# Altium schematic sheet 14_HD4_PUMP.SchDoc
size 420 x 297 mm; SheetNumber: 22; SheetTotal: 24
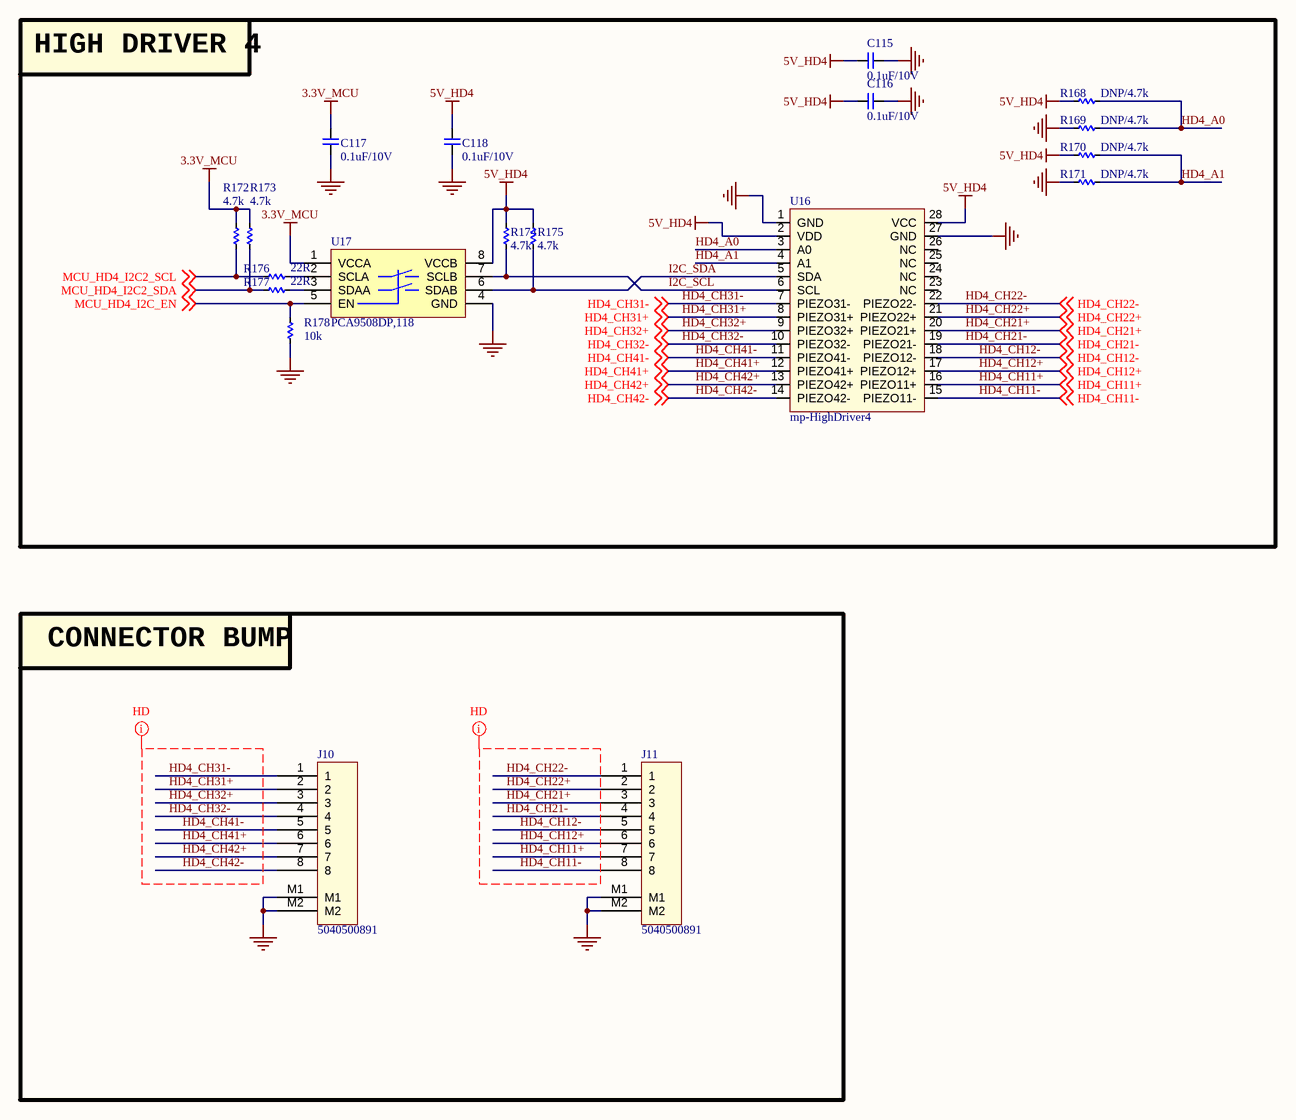
[diagram p0: 14_HD4_PUMP.SchDoc]

## Parts
C115  0.1uF/10V  [CAP_C_1005X60]
C116  0.1uF/10V  [CAP_C_1005X60]
C117  0.1uF/10V  [CAP_C_1005X60]
C118  0.1uF/10V  [CAP_C_1005X60]
J10  5040500891  [MOLEX_5040500891]
J11  5040500891  [MOLEX_5040500891]
R168  DNP/4.7k  [RES_C_1005X40]
R169  DNP/4.7k  [RES_C_1005X40]
R170  DNP/4.7k  [RES_C_1005X40]
R171  DNP/4.7k  [RES_C_1005X40]
R172  4.7k  [RES_C_1005X40]
R173  4.7k  [RES_C_1005X40]
R174  4.7k  [RES_C_1005X40]
R175  4.7k  [RES_C_1005X40]
R176  22R  [RES_C_1005X40]
R177  22R  [RES_C_1005X40]
R178  10k  [RES_C_1005X40]
U16  mp-HighDriver4  [MP_HIGHDRIVER4]
U17  PCA9508DP,118  [TSOP8]

## Blocks framed on the sheet
HIGH DRIVER 4: C115-C118 R168-R178 U16 U17
CONNECTOR BUMP: J10 J11

## Nets
3.3V_MCU: C117.2 R172.1 R173.1 U17.1(VCCA)
5V_HD4: C115.2 C116.2 C118.2 R168.1 R170.1 R174.1 R175.1 U16.2(VDD) U16.28(VCC) U17.8(VCCB)
GND: C115.1 C116.1 C117.1 C118.1 J10.M1 J10.M2 J11.M1 J11.M2 R169.1 R171.1 R178.2 U16.1(GND) U16.27(GND) U17.4(GND)
HD4_A0: R168.2 R169.2 U16.3(A0)
HD4_A1: R170.2 R171.2 U16.4(A1)
HD4_CH11+: J11.7 U16.16(PIEZO11+) ; off-sheet HD4_CH11+
HD4_CH11-: J11.8 U16.15(PIEZO11-) ; off-sheet HD4_CH11-
HD4_CH12+: J11.6 U16.17(PIEZO12+) ; off-sheet HD4_CH12+
HD4_CH12-: J11.5 U16.18(PIEZO12-) ; off-sheet HD4_CH12-
HD4_CH21+: J11.3 U16.20(PIEZO21+) ; off-sheet HD4_CH21+
HD4_CH21-: J11.4 U16.19(PIEZO21-) ; off-sheet HD4_CH21-
HD4_CH22+: J11.2 U16.21(PIEZO22+) ; off-sheet HD4_CH22+
HD4_CH22-: J11.1 U16.22(PIEZO22-) ; off-sheet HD4_CH22-
HD4_CH31+: J10.2 U16.8(PIEZO31+) ; off-sheet HD4_CH31+
HD4_CH31-: J10.1 U16.7(PIEZO31-) ; off-sheet HD4_CH31-
HD4_CH32+: J10.3 U16.9(PIEZO32+) ; off-sheet HD4_CH32+
HD4_CH32-: J10.4 U16.10(PIEZO32-) ; off-sheet HD4_CH32-
HD4_CH41+: J10.6 U16.12(PIEZO41+) ; off-sheet HD4_CH41+
HD4_CH41-: J10.5 U16.11(PIEZO41-) ; off-sheet HD4_CH41-
HD4_CH42+: J10.7 U16.13(PIEZO42+) ; off-sheet HD4_CH42+
HD4_CH42-: J10.8 U16.14(PIEZO42-) ; off-sheet HD4_CH42-
I2C_SCL: R174.2 U16.6(SCL) U17.7(SCLB)
I2C_SDA: R175.2 U16.5(SDA) U17.6(SDAB)
MCU_HD4_I2C2_SCL: R172.2 R176.2 ; off-sheet MCU_HD4_I2C2_SCL
MCU_HD4_I2C2_SDA: R173.2 R177.2 ; off-sheet MCU_HD4_I2C2_SDA
MCU_HD4_I2C_EN: R178.1 U17.5(EN) ; off-sheet MCU_HD4_I2C_EN
NetR176_1: R176.1 U17.2(SCLA)
NetR177_1: R177.1 U17.3(SDAA)

Not connected (* = marked no-connect by the designer): U16 23(NC) 24(NC) 25(NC) 26(NC)

## Layout directives
net class HD: HD4_CH11+, HD4_CH11-, HD4_CH12+, HD4_CH12-, HD4_CH21+, HD4_CH21-, HD4_CH22+, HD4_CH22-, HD4_CH31+, HD4_CH31-, HD4_CH32+, HD4_CH32-, HD4_CH41+, HD4_CH41-, HD4_CH42+, HD4_CH42-

## Notes on the sheet
- Project:
- BEE-PC1
- Sub-system:
- NANORACK_EXP_CONTROLLER
- Design by:
- SANG HUYNH
- BAO BUI Q.
- Sheet title:
- Sheet
- A3
- of
- Checked by:
- Approved by:
- VU PHAM
- Revision:
- Document No:
- V1.2.2
- Size:
- Date:

## Library data of the parts
C115-C118 = _CAP_C_2: CAP CHIP
J10 J11 = Header 8x1_2M
R168-R178 = _RES_B_2: RES
U16 = mp_HighDriver4